# Altium schematic sheet 07_Wireless.SchDoc
size A4
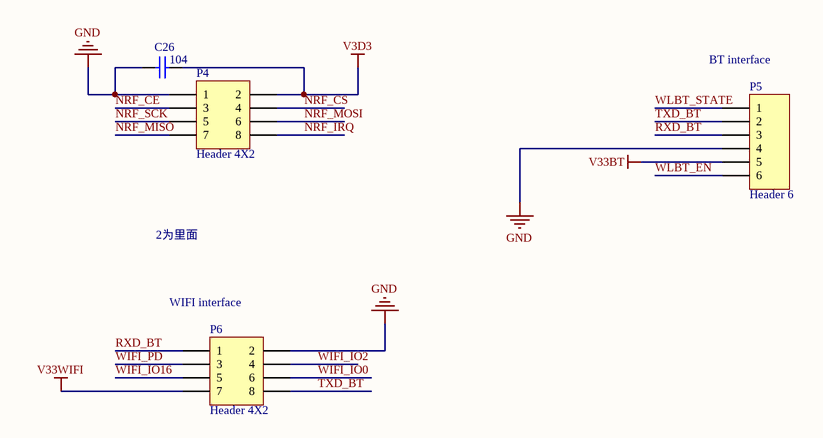
[diagram p0: 07_Wireless.SchDoc]

## Parts
C26  value 104  [0402]  (hidden comment: Cap)
P4  Header 4X2  [HDR2X4]
P5  Header 6  [HDR1X6]
P6  Header 4X2  [HDR2X4]

## Nets
GND: C26.1 P4.1 P5.4 P6.2
V3D3: C26.2 P4.2
V33BT: P5.5
V33WIFI: P6.7
NRF_CE: P4.3
NRF_CS: P4.4
NRF_IRQ: P4.8
NRF_MISO: P4.7
NRF_MOSI: P4.6
NRF_SCK: P4.5
RXD_BT: P5.3 P6.1
TXD_BT: P5.2 P6.8
WIFI_IO0: P6.6
WIFI_IO2: P6.4
WIFI_IO16: P6.5
WIFI_PD: P6.3
WLBT_EN: P5.6
WLBT_STATE: P5.1

## Notes on the sheet
- (near P5) BT interface
- 2为里面
- (near P6) WIFI interface

## Library data of the parts
C26 = Cap: Capacitor; Published: 8-Jun-2000; LatestRevisionDate: 17-Jul-2002; LatestRevisionNote: Re-released for DXP Platform.; PackageReference: RAD-0.3; Publisher: Altium Limited; PackageDescription: Radial Cap, Thru-Hole; 2 Leads; 0.3 in Pin Spacing
P4 P6 = Header 4X2: Header, 4-Pin, Dual row; LatestRevisionDate: 17-Jul-2002; LatestRevisionNote: Re-released for DXP Platform.; Publisher: Altium Limited
P5 = Header 6: Header, 6-Pin; LatestRevisionDate: 17-Jul-2002; LatestRevisionNote: Re-released for DXP Platform.; Publisher: Altium Limited